# EAGLE design Project13 (EAGLE 9.6.2)
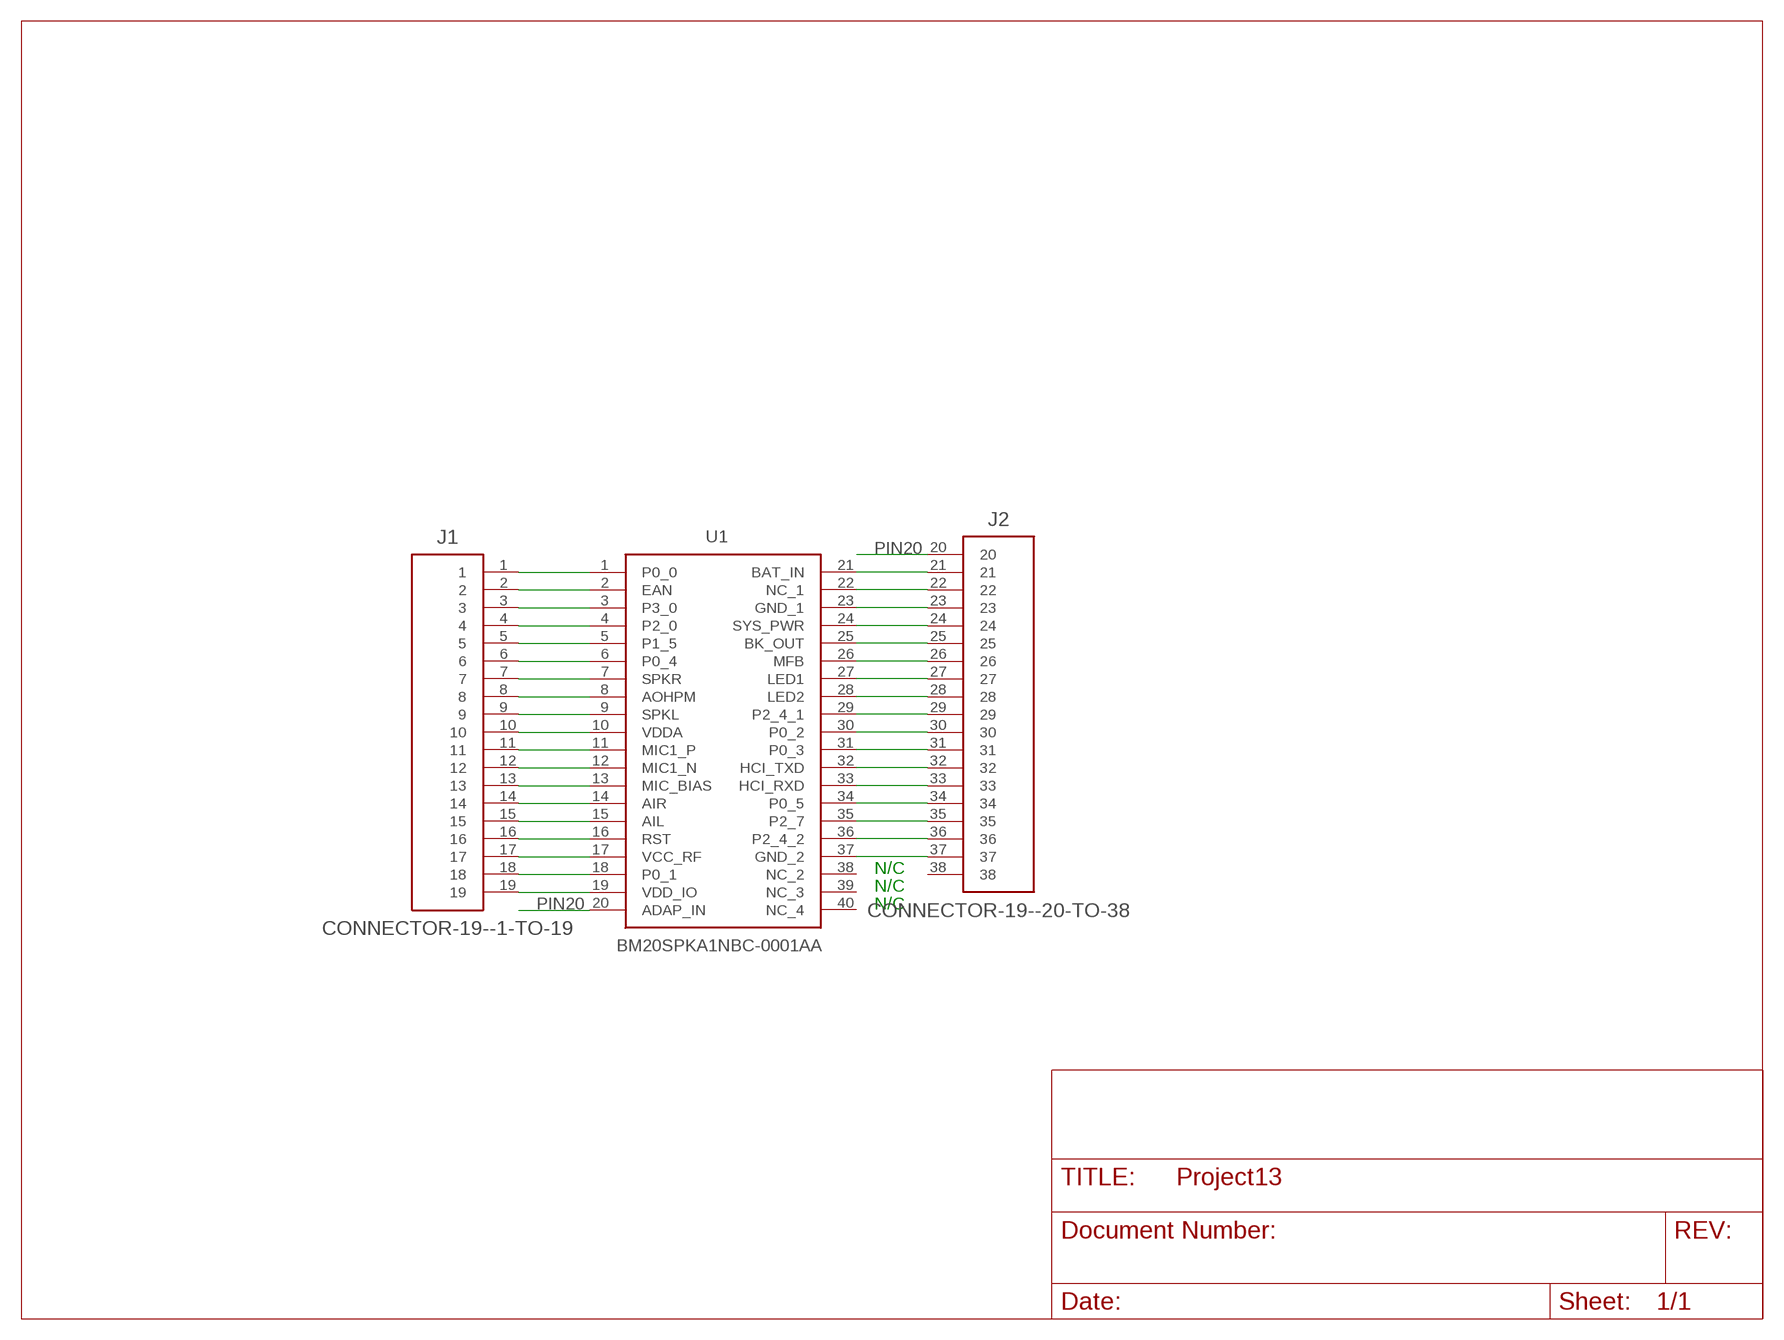
[diagram p0: schematic, sheet 1]

## Parts
J1  CONNECTOR-19--1-TO-19  [ESQ-119-XX-XX-S]
J2  CONNECTOR-19--20-TO-38  [ESQ-119-XX-XX-S--PIN-1-ROUND]
U1  BM20SPKA1NBC-0001AA  [BM20SPKA1NBC0001AA]

## Nets
N$1: J1.4 U1.4(P2_0)
N$2: J1.1 U1.1(P0_0)
N$3: J1.5 U1.5(P1_5)
N$4: J1.2 U1.2(EAN)
N$5: J1.6 U1.6(P0_4)
N$6: J1.3 U1.3(P3_0)
N$7: J1.7 U1.7(SPKR)
N$8: J1.8 U1.8(AOHPM)
N$9: J1.9 U1.9(SPKL)
N$10: J1.10 U1.10(VDDA)
N$11: J1.11 U1.11(MIC1_P)
N$12: J1.12 U1.12(MIC1_N)
N$13: J1.13 U1.13(MIC_BIAS)
N$14: J1.14 U1.14(AIR)
N$15: J1.15 U1.15(AIL)
N$16: J1.16 U1.16(RST)
N$17: J1.17 U1.17(VCC_RF)
N$18: J1.18 U1.18(P0_1)
N$19: J1.19 U1.19(VDD_IO)
N$20: J2.23 U1.23(GND_1)
N$21: J2.24 U1.24(SYS_PWR)
N$22: J2.21 U1.21(BAT_IN)
N$23: J2.25 U1.25(BK_OUT)
N$24: J2.22 U1.22(NC_1)
N$25: J2.26 U1.26(MFB)
N$26: J2.27 U1.27(LED1)
N$27: J2.28 U1.28(LED2)
N$28: J2.29 U1.29(P2_4_1)
N$29: J2.30 U1.30(P0_2)
N$30: J2.31 U1.31(P0_3)
N$31: J2.32 U1.32(HCI_TXD)
N$32: J2.33 U1.33(HCI_RXD)
N$33: J2.34 U1.34(P0_5)
N$34: J2.35 U1.35(P2_7)
N$35: J2.36 U1.36(P2_4_2)
N$36: J2.37 U1.37(GND_2)
PIN20: J2.20 U1.20(ADAP_IN)
Unconnected: J2.38 U1.38(NC_2) U1.39(NC_3) U1.40(NC_4)

## Notes on the sheet
- N/C
- N/C
- N/C

## Library data of the parts
J1 = eagle-library-engr-245-s22:CONNECTOR-19--1-TO-19
J2 = eagle-library-engr-245-s22:CONNECTOR-19--20-TO-38
U1 = eagle-library-engr-245-s22:BM20SPKA1NBC-0001AA: Bluetooth Modules (802.15.1) BT 4.1 Stereo Audio No-Shield/Antenna Source: Datasheet <https://componentsearchengine.com/Datasheets/1/BM20SPKA1NBC-0001AA.pdf>; DESCRIPTION: Bluetooth Modules (802.15.1) BT 4.1 Stereo Audio No-Shield/Antenna; HEIGHT: 2.5mm; MANUFACTURER_NAME: Microchip; MANUFACTURER_PART_NUMBER: BM20SPKA1NBC-0001AA; MOUSER_PART_NUMBER: 579-SPKA1NBC-0001AA; MOUSER_PRICE-STOCK: https://www.mouser.co.uk/ProductDetail/Microchip-Technology/BM20SPKA1NBC-0001AA?qs=uus7iwvxYD8HqvnWsd76VQ%3D%3D

## Board
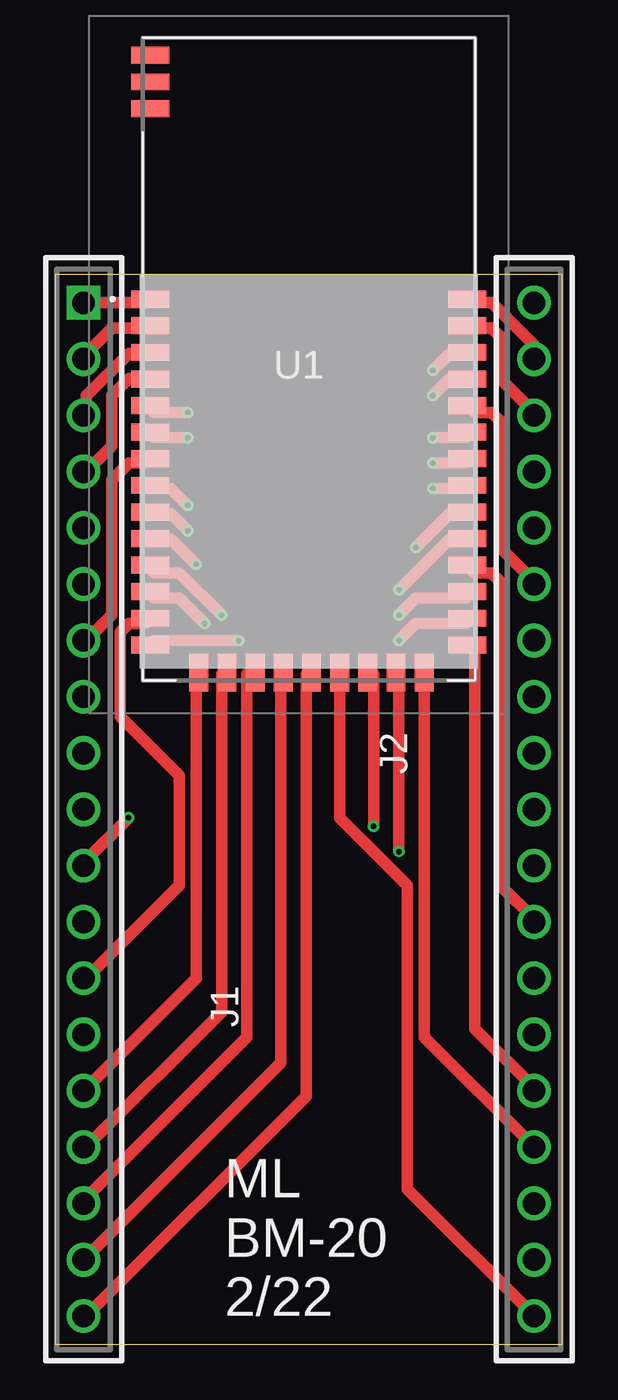
[diagram p1: board, top side]
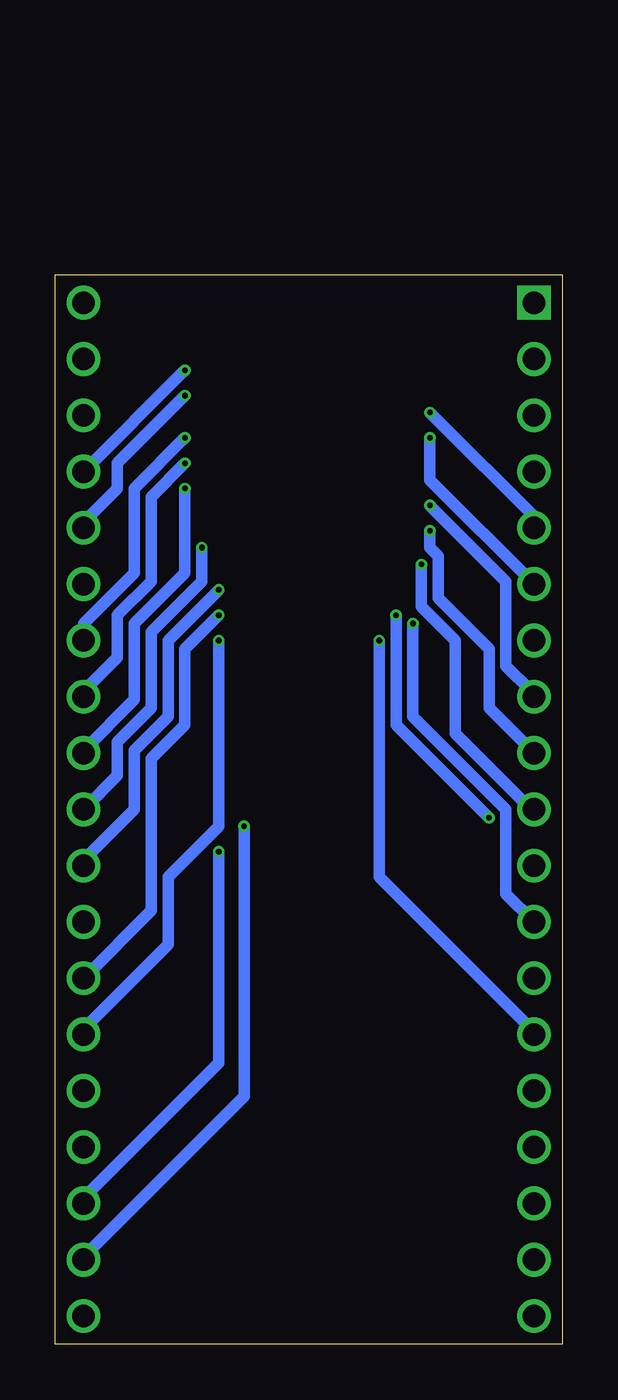
[diagram p2: board, bottom side, seen from below]

Size 22.86 x 48.26 mm. Coordinates in mm from the lower left corner, seen from the top.
Outline: 0,0 22.86,0 22.86,48.26 0,48.26 0,0
Copper layers (1*16): Top 0.035559375mm / dielectric 1.6mm / Bottom 0.035559375mm
Design rules "oshpark-2layer-tented": minimum track width 6mil, minimum drill 10mil, track to track 6mil, track to pad 6mil, pad to pad 6mil, via to via 6mil, smd to smd 6mil, copper to edge 15mil, drill to drill 6mil, minimum pad ring 5mil, minimum via ring 5mil, stop-mask expansion 2.5mil, vias tented up to drill 20mil, thermal gap 10mil

### Footprints (pad centres in the part's own frame; a part is rotated, then mirrored left to right if it is on the bottom)
ESQ-119-XX-XX-S = drill 1.016 pad 1.524 square: 1 0,0 | drill 1.016 pad 1.524: 2 2.54,0; 3 5.08,0; 4 7.62,0; 5 10.16,0; 6 12.7,0; 7 15.24,0; 8 17.78,0; 9 20.32,0; 10 22.86,0; 11 25.4,0; 12 27.94,0; 13 30.48,0; 14 33.02,0; 15 35.56,0; 16 38.1,0; 17 40.64,0; 18 43.18,0; 19 45.72,0
ESQ-119-XX-XX-S--PIN-1-ROUND = drill 1.016 pad 1.524: 20 -22.86,0; 21 -20.32,0; 22 -17.78,0; 23 -15.24,0; 24 -12.7,0; 25 -10.16,0; 26 -7.62,0; 27 -5.08,0; 28 -2.54,0; 29 0,0; 30 2.54,0; 31 5.08,0; 32 7.62,0; 33 10.16,0; 34 12.7,0; 35 15.24,0; 36 17.78,0; 37 20.32,0; 38 22.86,0
BM20SPKA1NBC0001AA = smd 1.7 x 0.76: 1 -7.15,2.7; 2 -7.15,1.5; 3 -7.15,0.3; 4 -7.15,-0.9; 5 -7.15,-2.1; 6 -7.15,-3.3; 7 -7.15,-4.5; 8 -7.15,-5.7; 9 -7.15,-6.9; 10 -7.15,-8.1; 11 -7.15,-9.3; 12 -7.15,-10.5; 13 -7.15,-11.7; 14 -7.15,-12.9; 24 7.15,-12.9; 25 7.15,-11.7; 26 7.15,-10.5; 27 7.15,-9.3; 28 7.15,-8.1; 29 7.15,-6.9; 30 7.15,-5.7; 31 7.15,-4.5; 32 7.15,-3.3; 33 7.15,-2.1; 34 7.15,-0.9; 35 7.15,0.3; 36 7.15,1.5; 37 7.15,2.7; 38 -7.15,13.7; 39 -7.15,12.5; 40 -7.15,11.3 | smd 0.85 x 1.7: 15 -4.96,-14.15; 16 -3.69,-14.15; 17 -2.42,-14.15; 18 -1.15,-14.15; 19 0.12,-14.15; 20 1.39,-14.15; 21 2.66,-14.15; 22 3.93,-14.15; 23 5.2,-14.15

### Placement (x,y rotation side)
J1  1.27,46.99 270 top
J2  21.59,24.13 90 top
U1  11.43,44.45 0 top

### Tracks (layer width: path | path; a pad name or v marks a point on that pad's centre or on a via)
N$1
  Top 0.508: U1.4 4.06,43.56 3.3,43.56 2.54,42.8 2.54,40.51 1.4,39.37 J1.4
N$2
  Top 0.508: J1.1 4.06,46.99 U1.1
N$3  (via drill 0.25)
  Top 0.508: v5.97,42.04 4.45,42.04 U1.5
  Bottom 0.508: v5.97,42.04 1.02,37.08 J1.5
N$4
  Top 0.508: U1.2 4.06,45.85 2.54,45.85 1.4,44.7 J1.2
N$5  (via drill 0.25)
  Top 0.508: v5.97,40.89 4.45,40.89 U1.6
  Bottom 0.508: v5.97,40.89 5.97,38.99 J1.6
N$6
  Top 0.508: U1.3 4.06,44.7 3.3,44.7 1.4,42.8 1.4,42.04 J1.3
N$7
  Top 0.508: U1.7 4.06,39.75 3.3,39.75 2.54,38.99 2.54,32.89 1.4,31.75 J1.7
N$8  (via drill 0.25)
  Top 0.508: v5.97,37.85 5.21,38.61 4.45,38.61 U1.8
  Bottom 0.508: v5.97,37.85 2.54,34.42 2.54,30.61 1.4,29.46 J1.8
N$9  (via drill 0.25)
  Top 0.508: v5.97,36.7 5.21,37.47 4.45,37.47 U1.9
  Bottom 0.508: v5.97,36.7 5.97,35.94 5.59,35.56 5.59,33.66 3.3,31.37 3.3,28.7 J1.9
N$10  (via drill 0.25)
  Top 0.508: v6.35,35.18 5.21,36.32 4.45,36.32 U1.10
  Bottom 0.508: v6.35,35.18 6.35,33.27 4.83,31.75 4.83,27.56 1.4,24.13 J1.10
N$11  (via drill 0.25)
  Top 0.508: v7.49,32.89 5.59,34.8 4.45,34.8 U1.11 | v3.3,23.75 1.4,21.84 J1.11
  Bottom 0.508: v7.49,32.89 7.49,27.94 v3.3,23.75
N$12  (via drill 0.25)
  Top 0.508: v6.73,32.51 5.59,33.66 4.45,33.66 U1.12
  Bottom 0.508: v6.73,32.51 6.73,28.32 2.54,24.13 2.54,20.32 J1.12
N$13
  Top 0.508: U1.13 4.06,32.51 3.3,32.51 2.92,32.13 2.92,28.32 5.59,25.65 5.59,20.7 1.4,16.51 J1.13
N$14  (via drill 0.25)
  Top 0.508: v8.26,31.75 4.45,31.75 U1.14
  Bottom 0.508: v8.26,31.75 8.26,21.08 1.4,14.22 J1.14
N$15
  Top 0.508: J1.15 6.35,16.51 6.35,30.23 U1.15
N$16
  Top 0.508: U1.16 7.49,30.23 7.49,14.99 1.4,8.89 J1.16
N$17
  Top 0.508: U1.17 8.64,30.23 8.64,13.84 1.4,6.6 J1.17
N$18
  Top 0.508: J1.18 10.16,12.7 10.16,30.23 U1.18
N$19
  Top 0.508: U1.19 11.3,30.23 11.3,11.18 1.4,1.27 J1.19
N$20
  Top 0.508: J2.23 16.64,13.84 16.64,30.23 U1.23
N$21
  Top 0.508: U1.24 18.92,31.37 18.92,14.22 21.59,11.56 J2.24
N$22  (via drill 0.25)
  Top 0.508: v14.35,23.37 14.35,30.23 U1.21
  Bottom 0.508: v14.35,23.37 14.35,11.18 21.59,3.94 J2.21
N$23  (via drill 0.25)
  Top 0.508: v15.49,31.75 16.26,32.51 18.54,32.51 U1.25
  Bottom 0.508: v15.49,31.75 15.49,23.37 17.78,21.08 17.78,18.03 21.59,14.22 J2.25
N$24  (via drill 0.25)
  Top 0.508: v15.49,22.23 15.49,30.23 U1.22
  Bottom 0.508: v15.49,22.23 15.49,12.7 21.59,6.6 J2.22
N$25  (via drill 0.25)
  Top 0.508: v15.49,32.89 16.26,33.66 18.54,33.66 U1.26
  Bottom 0.508: v15.49,32.89 17.02,31.37 17.02,27.94 18.54,26.42 18.54,19.56 J2.26
N$26
  Top 0.508: U1.27 18.92,34.8 19.68,34.8 20.07,34.42 20.07,20.7 21.59,19.18 J2.27
N$27  (via drill 0.25)
  Top 0.508: v15.49,34.04 17.78,36.32 18.54,36.32 U1.28
  Bottom 0.508: v15.49,34.04 17.78,31.75 17.78,28.32 19.3,26.8 19.3,24.13 21.59,21.84 J2.28
N$28  (via drill 0.25)
  Top 0.508: v16.26,35.94 17.78,37.47 18.54,37.47 U1.29
  Bottom 0.508: v16.26,35.94 16.26,34.42 18.54,32.13 18.54,28.7 20.07,27.18 20.07,25.65 J2.29
N$29  (via drill 0.25)
  Top 0.508: v17.02,38.61 18.54,38.61 U1.30
  Bottom 0.508: v17.02,38.61 17.02,34.8 19.3,32.51 19.3,29.08 21.59,26.8 J2.30
N$30  (via drill 0.25)
  Top 0.508: v17.02,39.75 18.54,39.75 U1.31
  Bottom 0.508: v17.02,39.75 18.54,38.23 18.54,34.42 20.07,32.89 20.07,30.99 21.59,29.46 J2.31
N$31  (via drill 0.25)
  Top 0.508: v17.02,40.89 18.54,40.89 U1.32
  Bottom 0.508: v17.02,40.89 19.3,38.61 19.3,34.8 21.59,32.51 J2.32
N$32
  Top 0.508: U1.33 18.92,42.04 19.68,42.04 20.07,41.66 20.07,35.94 21.59,34.42 J2.33
N$33  (via drill 0.25)
  Top 0.508: v17.02,42.8 17.78,43.56 18.54,43.56 U1.34
  Bottom 0.508: v17.02,42.8 20.07,39.75 20.07,38.61 21.59,37.08 J2.34
N$34  (via drill 0.25)
  Top 0.508: v17.02,43.94 17.78,44.7 18.54,44.7 U1.35
  Bottom 0.508: J2.35 v17.02,43.94
N$35
  Top 0.508: U1.36 18.92,45.85 19.68,45.85 20.07,45.47 20.07,43.56 21.59,42.04 J2.36
N$36
  Top 0.508: J2.37 21.59,45.09 19.68,46.99 18.92,46.99 U1.37
PIN20
  Top 0.508: J2.20 15.88,6.99 15.88,20.7 12.83,23.75 12.83,30.23 U1.20

### Text on the board
tPlace: ML / BM-20 / 2/22